# EAGLE design ProtoShield-v26 (EAGLE 6.5.0)
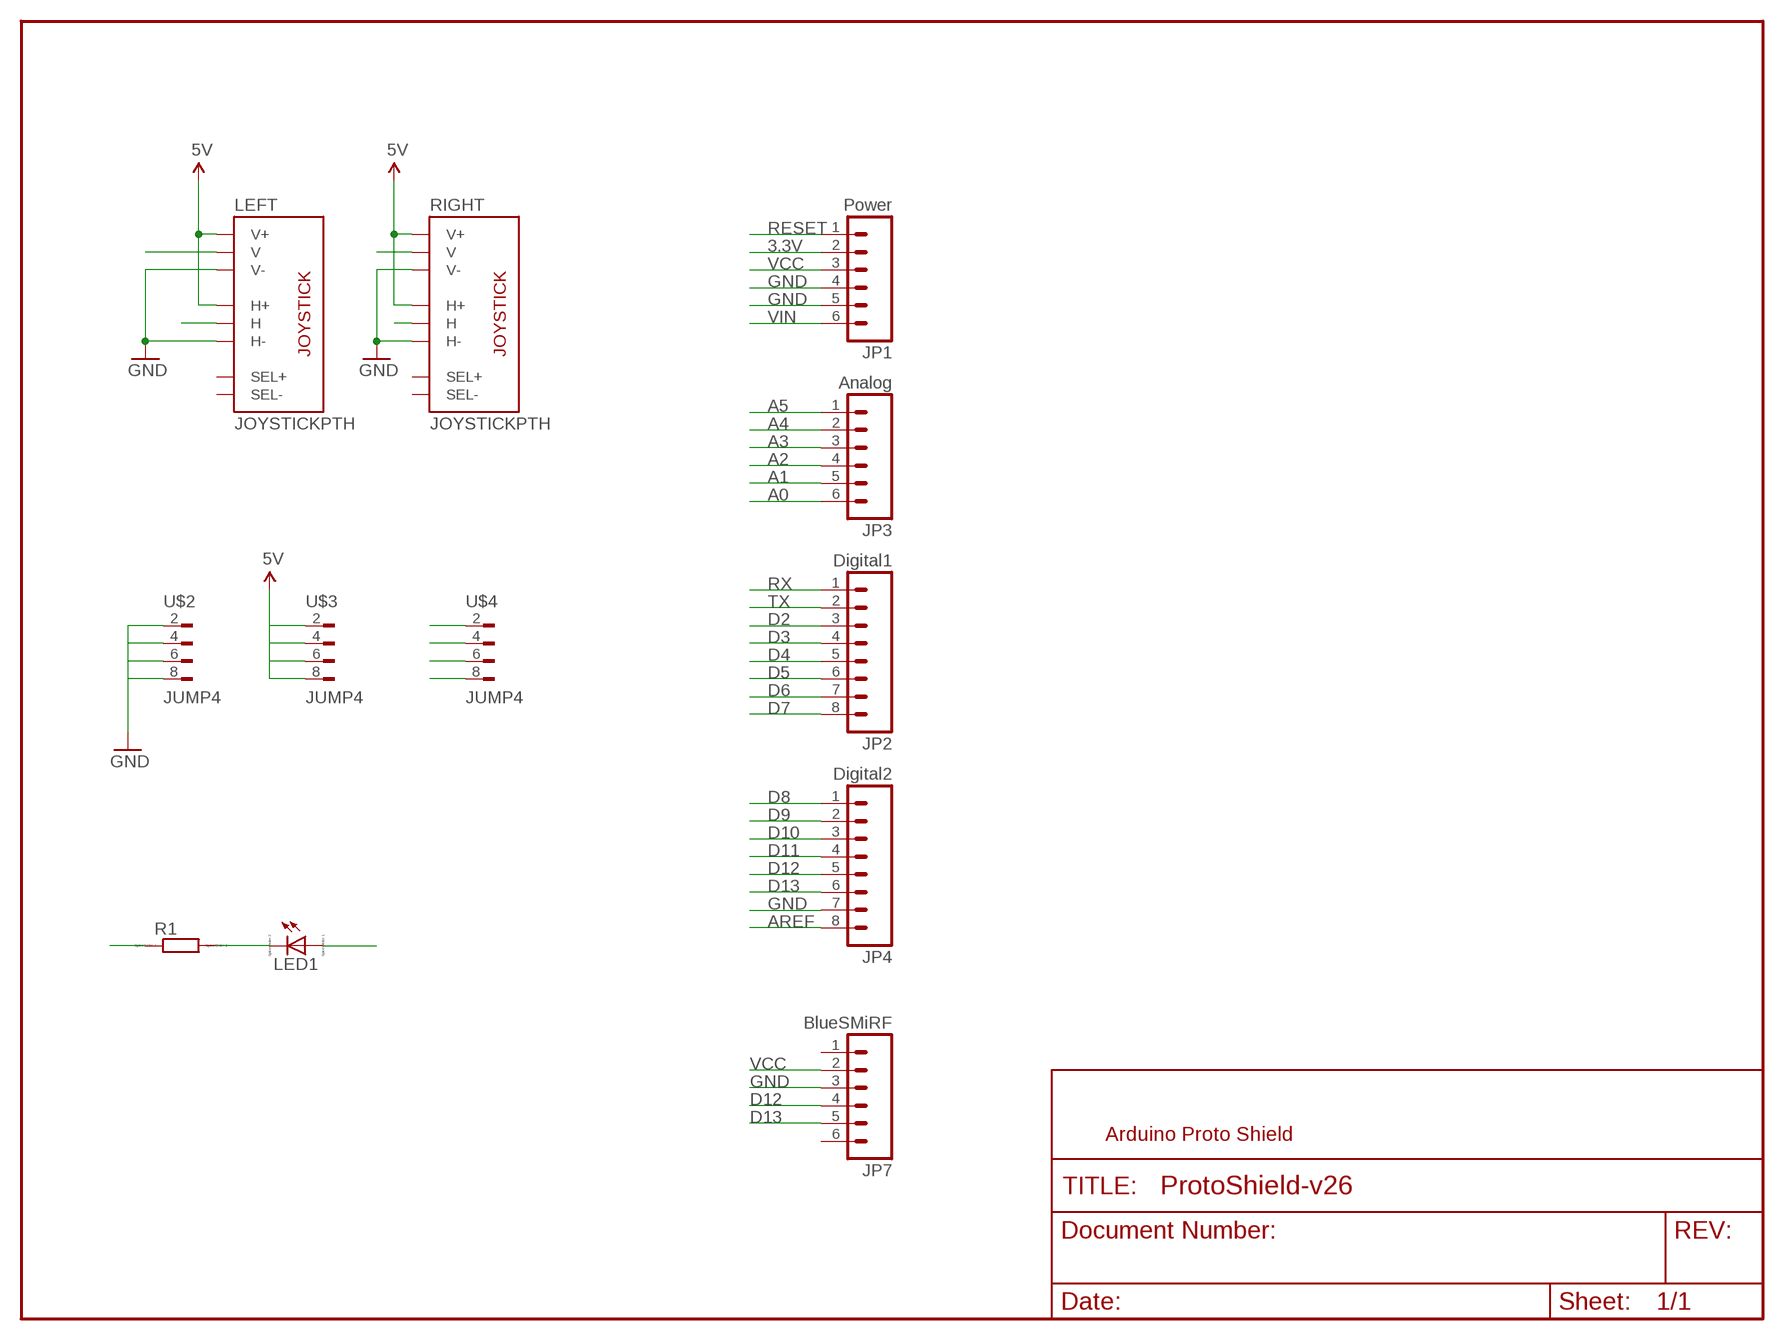
[diagram p0: schematic, sheet 1]

## Parts
JP1  Power  M06SIP  [1X06]
JP2  Digital1  M08  [1X08]
JP3  Analog  M06SIP  [1X06]
JP4  Digital2  M08  [1X08]
JP7  BlueSMiRF  M06SIP  [1X06]
LED1  LED_ELD260  [LED_LD260]
LEFT  JOYSTICKPTH  [JOYSTICK]
R1  R0204/7  [0204/7]
RIGHT  JOYSTICKPTH  [JOYSTICK]
U$2  JUMP4  [JUMP4]
U$3  JUMP4  [JUMP4]
U$4  JUMP4  [JUMP4]

## Nets
3.3V: JP1.2
A0: JP3.6 RIGHT.H2(H)
A1: JP3.5 RIGHT.V2(V)
A2: JP3.4 LEFT.V2(V)
A3: JP3.3 LEFT.H2(H)
A4: JP3.2
A5: JP3.1
AREF: JP4.8
D2: JP2.3
D3: JP2.4 LED1.A
D4: JP2.5
D5: JP2.6 U$4.2
D6: JP2.7
D7: JP2.8
D8: JP4.1
D9: JP4.2 U$4.4
D10: JP4.3 U$4.6
D11: JP4.4 U$4.8
D12: JP4.5 JP7.4
D13: JP4.6 JP7.5
GND [power]: JP1.4 JP1.5 JP4.7 JP7.3 LEFT.H3(H-) LEFT.V3(V-) R1.1 RIGHT.H3(H-) RIGHT.V3(V-) U$2.2 U$2.4 U$2.6 U$2.8
N$1: LED1.K(C) R1.2
RESET: JP1.1
RX: JP2.1
TX: JP2.2
VCC: JP1.3 JP7.2 LEFT.H1(H+) LEFT.V1(V+) RIGHT.H1(H+) RIGHT.V1(V+) U$3.2 U$3.4 U$3.6 U$3.8 ; supply symbol labelled 5V
VIN [power]: JP1.6
Unconnected: JP7.1 JP7.6 LEFT.B1A(SEL+) LEFT.B2A(SEL-) RIGHT.B1A(SEL+) RIGHT.B2A(SEL-)

## Notes on the sheet
- Arduino Proto Shield

## Library data of the parts
JP1 JP3 JP7 = SparkFun:M06: Header 6 Standard 6-pin 0.1" header. Use with straight break away headers (SKU : PRT-00116), right angle break away headers (PRT-00553), swiss pins (PRT-00743), machine pins (PRT-00117), and female headers (PRT-00115). Molex polarized connector foot print use with SKU : PRT-08094 with associated crimp pins and housings. NOTES ON THE VARIANTS LOCK and LOCK_LONGPADS... This footprint was designed to help hold the alignment of a through-hole component (i.e. 6-pin header) while soldering it into place. You may notice that each hole has been shifted either up or down by 0.005 of an inch from it's more standard position (which is a perfectly straight line). This slight alteration caused the pins (the squares in the middle) to touch the edges of the holes. Because they are alternating, it causes a "brace" to hold the component in place. 0.005 has proven to be the perfect amount of "off-center" position when using our standard breakaway headers. Although looks a little odd when you look at the bare footprint, once you have a header in there, the alteration is very hard to notice. Also, if you push a header all the way into place, it is covered up entirely on the bottom side. This idea of altering the position of holes to aid alignment will be further integrated into the Sparkfun Library for other footprints. It can help hold any component with 3 or more connection pins.
JP2 JP4 = SparkFun:M08: Header 8 Standard 8-pin 0.1" header. Use with straight break away headers (SKU : PRT-00116), right angle break away headers (PRT-00553), swiss pins (PRT-00743), machine pins (PRT-00117), and female headers (PRT-00115).
LED1 = eagle-ltspice:LED_E: LED Source: http://www.osram.convergy.de Source: www.luxeon.com Source: www.kingbright.com; SPICEMODEL: NONE; SPICEPREFIX: D; SPICETYPE: diode
LEFT RIGHT = SparkFun:JOYSTICK: Thumb Joystick Joystick commonly found in PS2 controllers. Two pots and a select switch. Footprint proven. Spark Fun Electronics SKU : COM-09032
R1 = eagle-ltspice:R: RESISTOR, European symbol; SPICEMODEL: NONE; SPICEPREFIX: R
U$2-U$4 = 00mylib:JUMP4

## Net classes
1 power: width 0.254 mm

## Board
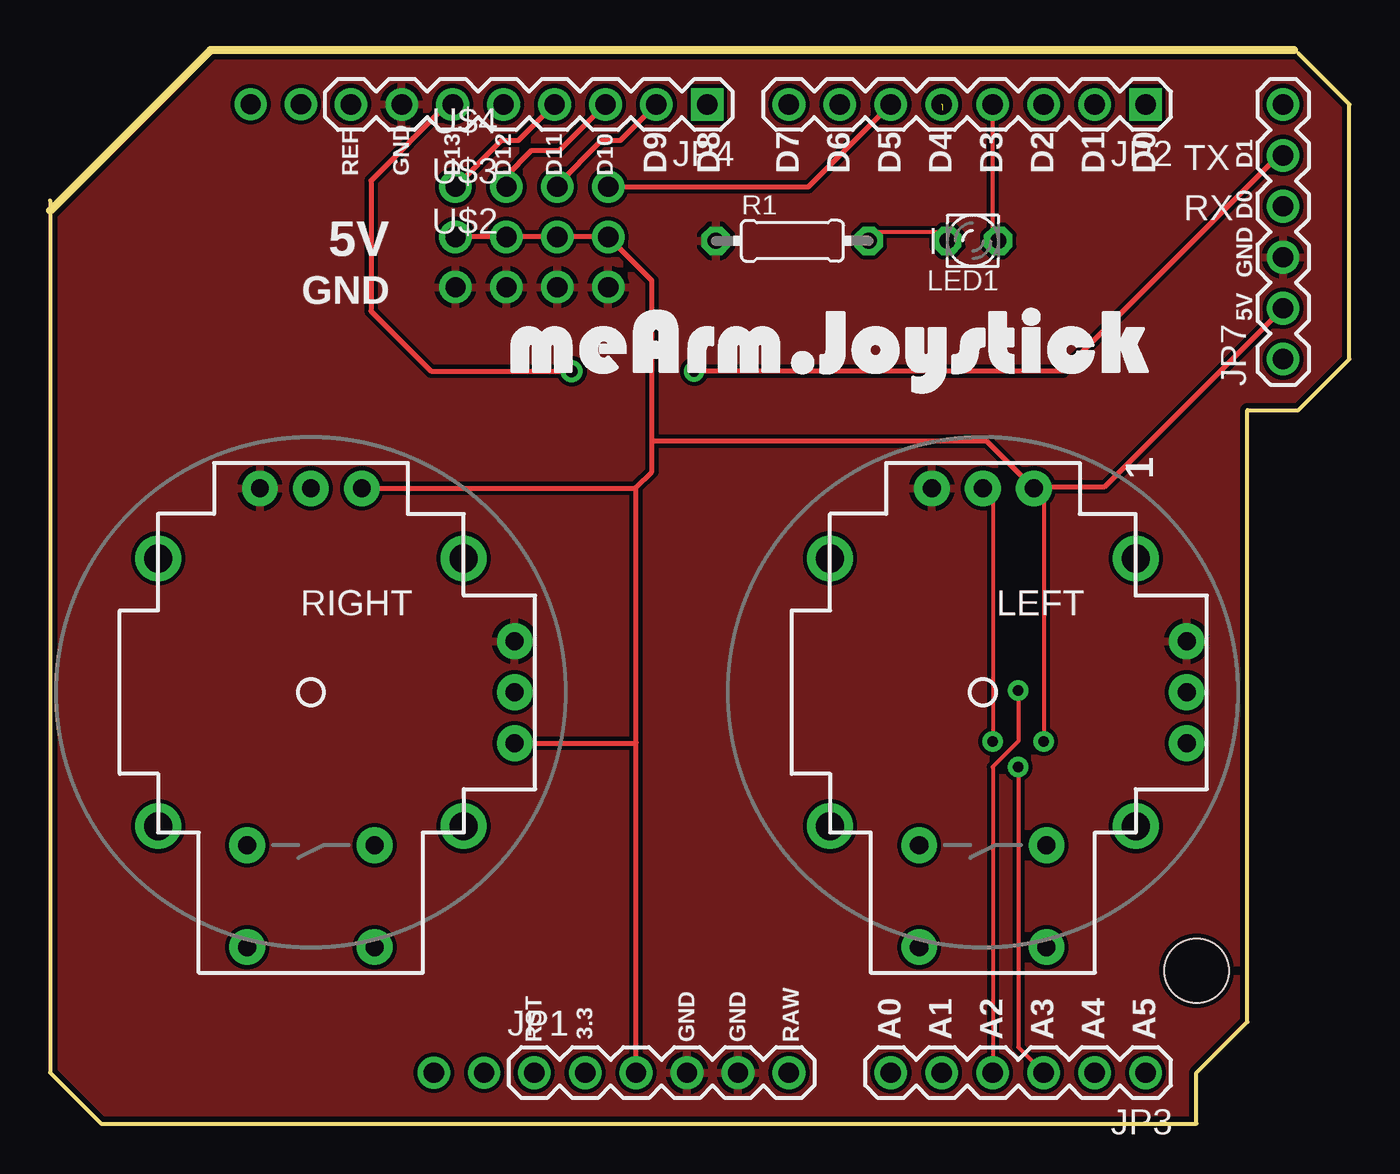
[diagram p1: board, top side]
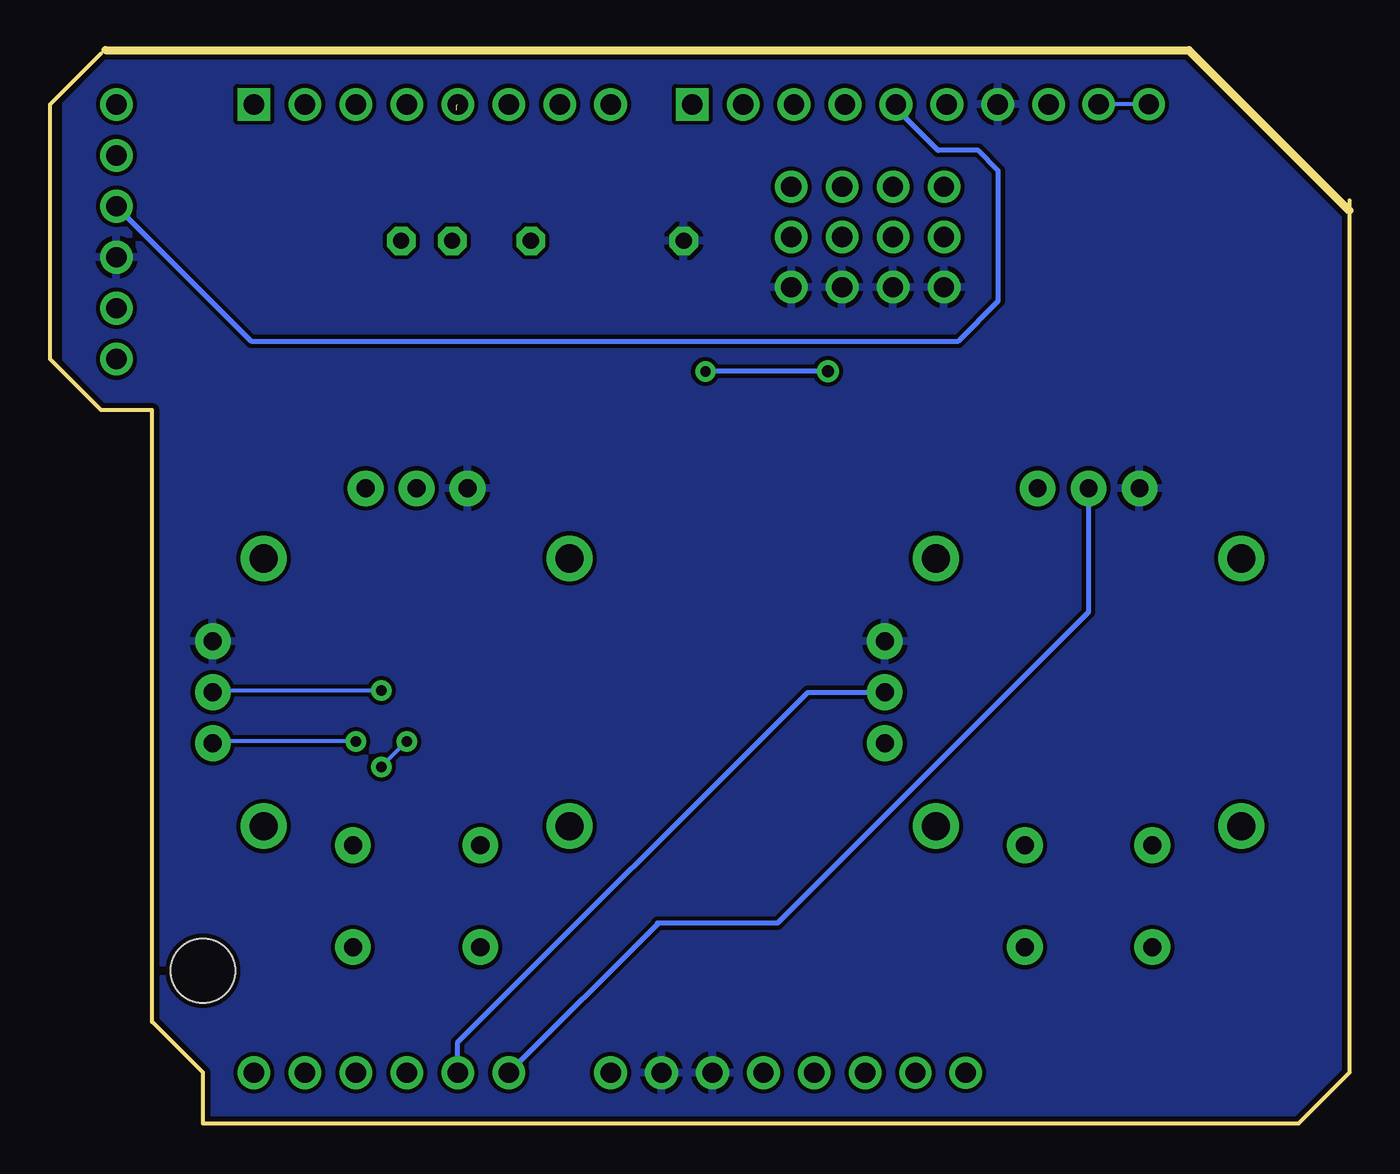
[diagram p2: board, bottom side, seen from below]

Size 64.77 x 53.5 mm. Coordinates in mm from the lower left corner, seen from the top.
Outline: 0,46 0,45.5
Outline: 0,45.5 0,2.54 2.54,0 57.15,0 57.15,2.54 59.69,5.08 59.69,35.56 62.23,35.56 64.77,38.1 64.77,50.8 62.23,53.34
Outline: 62,53.5 8,53.5 0,45.5
Copper layers (1*16): Top 0.035mm / dielectric 1.5mm / Bottom 0.035mm
Design rules "SparkFun *": minimum track width 8mil, minimum drill 20mil, track to track 8mil, track to pad 8mil, pad to pad 8mil, via to via 8mil, smd to smd 8mil, copper to edge 10mil, drill to drill 8mil, minimum pad ring 12mil, minimum via ring 10mil, stop-mask expansion 4mil, vias tented up to drill 0.7mm, thermal gap 10mil
Holes 3.2 mm at 57.15,7.62

### Footprints (pad centres in the part's own frame; a part is rotated, then mirrored left to right if it is on the bottom)
1X06 = drill 1.016: 1 0,0; 2 2.54,0; 3 5.08,0; 4 7.62,0; 5 10.16,0; 6 12.7,0
1X08 = drill 1.016 square: 1 0,0 | drill 1.016: 2 2.54,0; 3 5.08,0; 4 7.62,0; 5 10.16,0; 6 12.7,0; 7 15.24,0; 8 17.78,0
LED_LD260 = drill 0.813 octagon: A -1.27,0; K 1.27,0
JOYSTICK = drill 0.9 pad 1.778: B1A -3.175,12.7; B1B 3.175,12.7; B2A -3.175,7.62; B2B 3.175,7.62 | drill 0.889 pad 1.778: H1 -2.54,-10.16; H2 0,-10.16; H3 2.54,-10.16; V1 -10.16,2.54; V2 -10.16,0; V3 -10.16,-2.54 | drill 1.397 pad 2.286: MOUNT1 -7.62,6.668; MOUNT2 -7.62,-6.668; MOUNT3 7.62,-6.668; MOUNT4 7.62,6.668
0204/7 = drill 0.813 octagon: 1 -3.81,0; 2 3.81,0
JUMP4 = drill 1 pad 1.6: 2 9.325,0.19; 4 6.785,0.19; 6 4.245,0.19; 8 1.705,0.19

### Placement (x,y rotation side)
JP1  24.13,2.54 0 top
JP2  54.61,50.8 180 top
JP3  54.61,2.54 180 top
JP4  32.77,50.8 180 top
JP7  61.47,38.1 90 top
LED1  46,44 180 top
LEFT  46.5,21.5 180 top
R1  37,44 0 top
RIGHT  13,21.5 180 top
U$2  18.5,41.5 0 top
U$3  18.5,44 0 top
U$4  18.5,46.5 0 top

### Tracks (layer width: path | path; a pad name or v marks a point on that pad's centre or on a via)
A0
  Bottom 0.254: RIGHT.H2 13,25.5 28.5,10 34.5,10 34.5,9.95 JP3.6
A1
  Bottom 0.254: JP3.5 44.45,4.05 27,21.5 RIGHT.V2
A2  (via drill 0.51)
  Top 0.203: JP3.4 46.99,17.78 48.26,19.05 v48.26,21.59
  Bottom 0.203: v48.26,21.59 55.88,21.59 LEFT.V2
A3  (via drill 0.51)
  Top 0.203: JP3.3 48.26,3.81 v48.26,17.78 | v46.99,19.05 46.99,31.75 LEFT.H2
  Bottom 0.203: v46.99,19.05 v48.26,17.78
D3
  Top 0.203: JP2.4 46.99,44.45 LED1.A
D4  (2 unrouted)
D5
  Top 0.254: U$4.2 37.8,46.69 JP2.6
D9
  Top 0.254: U$4.4 25.29,46.78 27.5,49 28.43,49 JP4.2
D10
  Top 0.254: U$4.6 22.75,47.24 24,48.5 25.39,48.5 JP4.3
D11
  Top 0.254: U$4.8 20.2,46.7 22.5,49 23.35,49 JP4.4
D12
  Bottom 0.254: JP7.4 54.75,39 19.5,39 17.5,41 17.5,47.5 18.5,48.5 20.5,48.5 22.61,50.61 JP4.5
D13  (via drill 0.51, 0.6)
  Top 0.254: JP4.6 19.8,50.8 16,47 16,40.5 19,37.5 v26,37.5 | JP7.5 61.26,48.26 50.5,37.5 v32.11,37.5 v32.1,37.49
  Bottom 0.254: v26,37.5 v32.09,37.5
  Bottom 0.406: v32.09,37.5 v32.1,37.49
GND
  pour Top: 0,54 65,54 65,0 0,0
  pour Bottom: 0,53 64,53 64,0.5 0,0.5 0,52.5
N$1
  Top 0.203: LED1.K 44.45,44.45 40.64,44.45 R1.2
N$2  (via drill 1 pad 1.6)
  Top 0.203: 10.16,50.8 v10,50.8
  Bottom 0.203: 12.7,50.8 v12.5,50.8 v10,50.8
N$3  (via drill 1 pad 1.6)
  Bottom 0.203: 19.05,2.54 v19.13,2.54
N$4  (via drill 1 pad 1.6)
  other vias: 21.63,2.54
VCC  (via drill 0.51)
  Top 0.203: v49.53,19.05 49.53,31.75 LEFT.H1
  Top 0.254: JP1.3 29.21,19 | 29.21,19 29.21,31.71 | 29.21,31.71 30,32.5 30,34 | 30,34 30,42.02 U$3.2 U$3.4 U$3.6 U$3.8 | RIGHT.V1 29.17,18.96 29.21,19 | RIGHT.H1 29.16,31.66 29.21,31.71 | LEFT.H1 46.7,34 30,34 | 49.53,31.75 52.58,31.75 JP7.2
  Bottom 0.203: 15.24,31.75 RIGHT.H1 | v49.53,19.05 55.88,19.05 LEFT.V1

### Text on the board
tPlace: TX | D1 | REF | GND | D13 | D12 | D11 | D10 | D9 | D8 | D7 | D6 | D5 | D4 | D3 | D2 | D1 | D0 | 5V | RX | D0 | GND | GND | 5V | 1 | RST | 3.3 | GND | GND | RAW | A0 | A1 | A2 | A3 | A4 | A5 | /Users/lienhungcheng/Desktop/silk.bmp | /Users/lienhungcheng/Desktop/silk.bmp